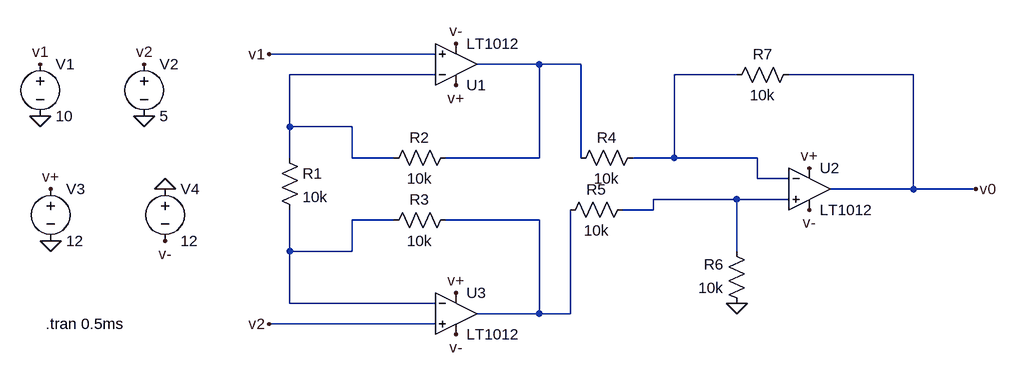
[diagram p0: schematic instrumentation amplifier.asc]
instrumentation amplifier.asc, the LTspice schematic file:
Version 4
SHEET 1 940 680
WIRE 64 32 -192 32
WIRE 224 48 128 48
WIRE 288 48 224 48
WIRE 64 64 -160 64
WIRE 528 64 432 64
WIRE 800 64 608 64
WIRE -160 144 -160 64
WIRE -64 144 -160 144
WIRE -160 192 -160 144
WIRE -64 192 -64 144
WIRE 0 192 -64 192
WIRE 224 192 224 48
WIRE 224 192 80 192
WIRE 288 192 288 48
WIRE 432 192 432 64
WIRE 432 192 368 192
WIRE 560 192 432 192
WIRE 560 224 560 192
WIRE 608 224 560 224
WIRE 800 240 800 64
WIRE 800 240 672 240
WIRE 896 240 800 240
WIRE 528 256 400 256
WIRE 608 256 528 256
WIRE 400 272 400 256
WIRE 400 272 352 272
WIRE 0 288 -64 288
WIRE 224 288 80 288
WIRE -160 336 -160 272
WIRE -64 336 -64 288
WIRE -64 336 -160 336
WIRE 528 336 528 256
WIRE -160 416 -160 336
WIRE 64 416 -160 416
WIRE 224 432 224 288
WIRE 224 432 128 432
WIRE 272 432 272 272
WIRE 272 432 224 432
WIRE 64 448 -192 448
FLAG -192 32 v1
FLAG -192 448 v2
FLAG 896 240 v0
FLAG 528 416 0
FLAG -544 48 v1
FLAG -384 48 v2
FLAG -544 128 0
FLAG -384 128 0
FLAG -528 240 v+
FLAG -352 320 v-
FLAG -528 320 0
FLAG -352 240 0
FLAG 96 80 v+
FLAG 96 400 v+
FLAG 640 208 v+
FLAG 96 16 v-
FLAG 96 464 v-
FLAG 640 272 v-
SYMBOL OpAmps\\LT1012 96 112 M180
SYMATTR InstName U1
SYMBOL OpAmps\\LT1012 640 176 R0
SYMATTR InstName U2
SYMBOL OpAmps\\LT1012 96 368 R0
SYMATTR InstName U3
SYMBOL res -176 176 R0
SYMATTR InstName R1
SYMATTR Value 10k
SYMBOL res 96 176 R90
WINDOW 0 0 56 VBottom 2
WINDOW 3 32 56 VTop 2
SYMATTR InstName R2
SYMATTR Value 10k
SYMBOL res 96 272 R90
WINDOW 0 0 56 VBottom 2
WINDOW 3 32 56 VTop 2
SYMATTR InstName R3
SYMATTR Value 10k
SYMBOL res 384 176 R90
WINDOW 0 0 56 VBottom 2
WINDOW 3 32 56 VTop 2
SYMATTR InstName R4
SYMATTR Value 10k
SYMBOL res 368 256 R90
WINDOW 0 0 56 VBottom 2
WINDOW 3 32 56 VTop 2
SYMATTR InstName R5
SYMATTR Value 10k
SYMBOL res 544 432 R180
WINDOW 0 36 76 Left 2
WINDOW 3 36 40 Left 2
SYMATTR InstName R6
SYMATTR Value 10k
SYMBOL res 512 80 R270
WINDOW 0 32 56 VTop 2
WINDOW 3 0 56 VBottom 2
SYMATTR InstName R7
SYMATTR Value 10k
SYMBOL voltage -544 32 R0
WINDOW 123 0 0 Left 0
WINDOW 39 0 0 Left 0
SYMATTR InstName V1
SYMATTR Value 10
SYMBOL voltage -384 32 R0
WINDOW 123 0 0 Left 0
WINDOW 39 0 0 Left 0
SYMATTR InstName V2
SYMATTR Value 5
SYMBOL voltage -528 224 R0
WINDOW 123 0 0 Left 0
WINDOW 39 0 0 Left 0
SYMATTR InstName V3
SYMATTR Value 12
SYMBOL voltage -352 224 R0
WINDOW 123 0 0 Left 0
WINDOW 39 0 0 Left 0
SYMATTR InstName V4
SYMATTR Value 12
TEXT -536 448 Left 2 !.tran 0.5ms

The netlist it stands for:
* instrumentation amplifier.asc
XU1 v1 N002 v+ v- N001 LT1012  ; pins In+ In- V+ V- OUT
XU2 N004 N003 v+ v- v0 LT1012  ; pins In+ In- V+ V- OUT
XU3 v2 N005 v+ v- N006 LT1012  ; pins In+ In- V+ V- OUT
R1 N002 N005 10k
R2 N001 N002 10k
R3 N006 N005 10k
R4 N003 N001 10k
R5 N004 N006 10k
R6 0 N004 10k
R7 N003 v0 10k
V1 v1 0 10
V2 v2 0 5
V3 v+ 0 12
V4 0 v- 12
.tran 0.5ms
.backanno
.end